# EAGLE design pcb_telemetria (EAGLE 9.4.2)

## Sheet 1 of 5
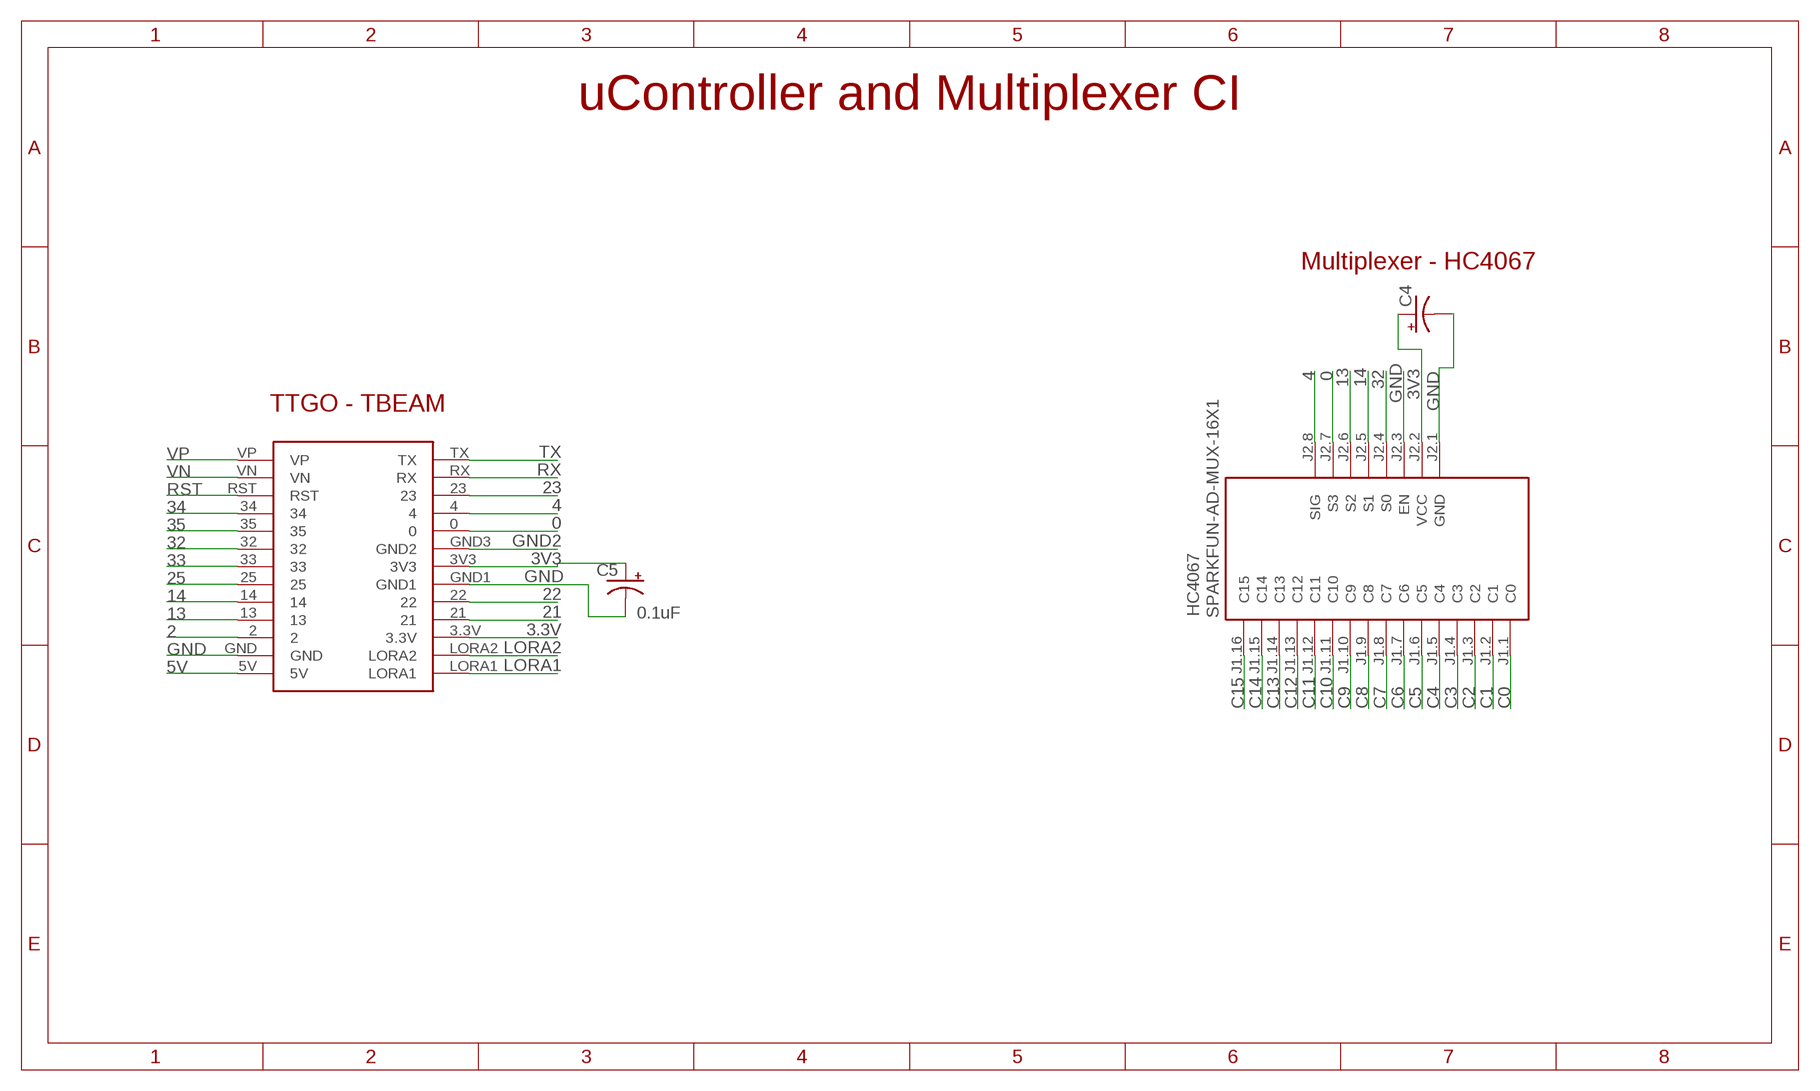
[diagram p0: schematic, sheet 1]

### Parts
C4  CPOL-USE5-5  [E5-5]
C5  0.1uF  CPOL-USE5-5  [E5-5]
HC4067  SPARKFUN-AD-MUX-16X1  [SPARKFUN-AD-MUX-16X1]
U$1  TTGOBEAM  [TTGOBEAM]

### Nets
0: HC4067.J2.7(S3) U$1.0
2: U$1.2 ; also sheet 2
3.3V: U$1.3.3V
3V3: C4.+ C5.+ HC4067.J2.2(VCC) U$1.3V3
4: HC4067.J2.8(SIG) U$1.4
5V: U$1.5V
13: HC4067.J2.6(S2) U$1.13
14: HC4067.J2.5(S1) U$1.14
21: U$1.21 ; also sheet 2
22: U$1.22 ; also sheet 2
23: U$1.23 ; also sheet 2
25: U$1.25 ; also sheet 2
32: HC4067.J2.4(S0) U$1.32
33: U$1.33 ; also sheet 2
34: U$1.34
35: U$1.35
C0: HC4067.J1.1(C0) ; also sheet 4
C1: HC4067.J1.2(C1) ; also sheet 4
C2: HC4067.J1.3(C2) ; also sheet 4
C3: HC4067.J1.4(C3) ; also sheet 4
C4: HC4067.J1.5(C4) ; also sheet 4
C5: HC4067.J1.6(C5) ; also sheet 4
C6: HC4067.J1.7(C6) ; also sheet 3
C7: HC4067.J1.8(C7) ; also sheet 4
C8: HC4067.J1.9(C8) ; also sheet 4
C9: HC4067.J1.10(C9) ; also sheet 4
C10: HC4067.J1.11(C10) ; also sheet 3
C11: HC4067.J1.12(C11) ; also sheet 3
C12: HC4067.J1.13(C12) ; also sheet 3
C13: HC4067.J1.14(C13) ; also sheet 4
C14: HC4067.J1.15(C14) ; also sheet 3
C15: HC4067.J1.16(C15) ; also sheet 3
GND: C4.- C5.- HC4067.J2.1(GND) HC4067.J2.3(EN) U$1.GND U$1.GND1 ; also sheet 2,3,4,5
GND2: U$1.GND3(GND2)
LORA1: U$1.LORA1
LORA2: U$1.LORA2
RST: U$1.RST
RX: U$1.RX ; also sheet 2
TX: U$1.TX ; also sheet 2
VN: U$1.VN
VP: U$1.VP

### Notes on the sheet
- uController and Multiplexer CI
- Multiplexer - HC4067
- TTGO - TBEAM

## Sheet 2 of 5
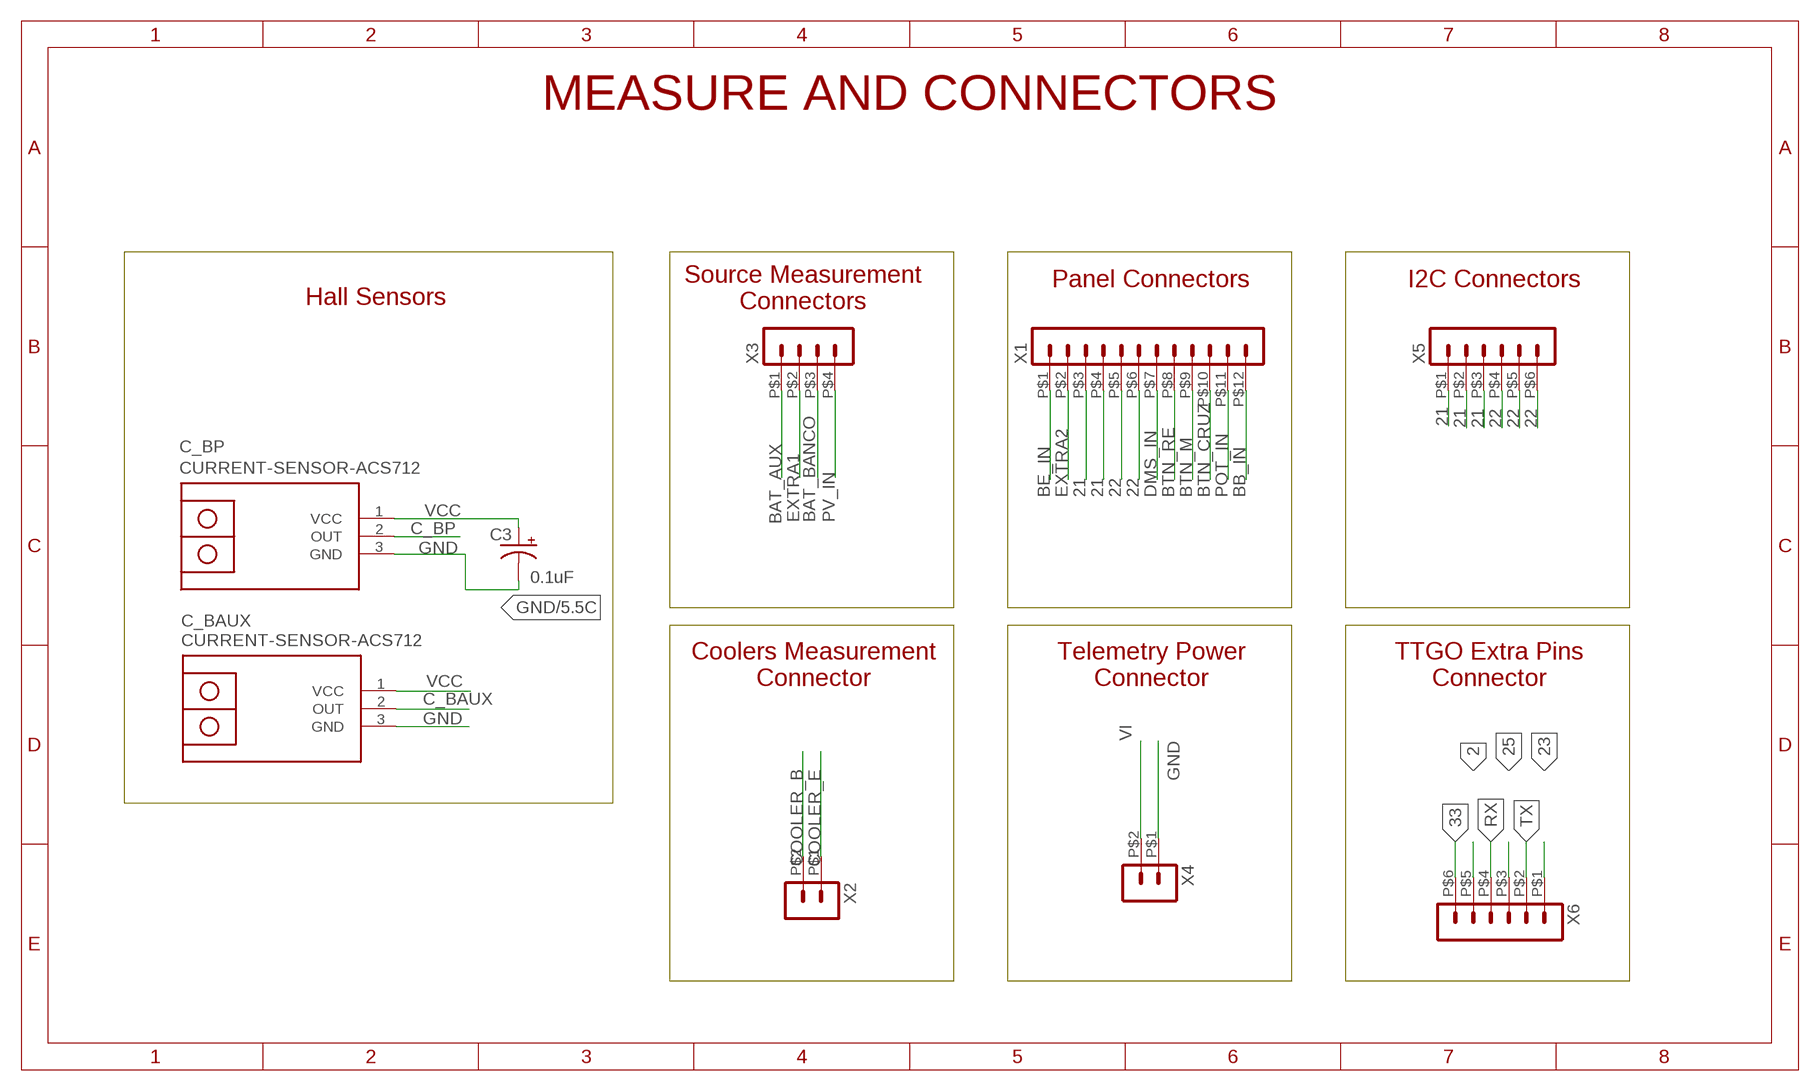
[diagram p1: schematic, sheet 2]

### Parts
C3  0.1uF  CPOL-USE5-5  [E5-5]
C_BAUX  CURRENT-SENSOR-ACS712  [CURRENT-SENSOR-ACS712]
C_BP  CURRENT-SENSOR-ACS712  [CURRENT-SENSOR-ACS712]
X1  HEADER_POS12_43045-1212  [43045-1212]
X2  HEADER_POS2_43045-0212  [43045-0212]
X3  HEADER_POS4_43045-0412  [43045-0412]
X4  HEADER_POS2_43045-0212  [43045-0212]
X5  HEADER_POS6_43045-0612  [43045-0612]
X6  HEADER_POS6_43045-0612  [43045-0612]

### Nets
2: X6.P$5 ; also sheet 1
21: X1.P$3 X1.P$4 X5.P$1 X5.P$2 X5.P$3 ; also sheet 1
22: X1.P$5 X1.P$6 X5.P$4 X5.P$5 X5.P$6 ; also sheet 1
23: X6.P$1 ; also sheet 1
25: X6.P$3 ; also sheet 1
33: X6.P$6 ; also sheet 1
BAT_AUX: X3.P$1 ; also sheet 3
BAT_BANCO: X3.P$3 ; also sheet 3
BB_IN: X1.P$12 ; also sheet 4
BE_IN: X1.P$1 ; also sheet 4
BTN_CRUZ: X1.P$10 ; also sheet 4
BTN_M: X1.P$9 ; also sheet 4
BTN_RE: X1.P$8 ; also sheet 4
C_BAUX: C_BAUX.2(OUT) ; also sheet 3
C_BP: C_BP.2(OUT) ; also sheet 3
COOLER_B: X2.P$2 ; also sheet 4
COOLER_E: X2.P$1 ; also sheet 4
DMS_IN: X1.P$7 ; also sheet 4
EXTRA1: X3.P$2 ; also sheet 4
EXTRA2: X1.P$2 ; also sheet 4
GND: C3.- C_BAUX.3(GND) C_BP.3(GND) X4.P$1 ; also sheet 1,3,4,5
POT_IN: X1.P$11 ; also sheet 3
PV_IN: X3.P$4 ; also sheet 3
RX: X6.P$4 ; also sheet 1
TX: X6.P$2 ; also sheet 1
VCC: C3.+ C_BAUX.1(VCC) C_BP.1(VCC) ; also sheet 5
VI: X4.P$2 ; also sheet 5

### Notes on the sheet
- MEASURE AND CONNECTORS
- Source Measurement
  Connectors
- Panel Connectors | I2C Connectors
- Hall Sensors
- Coolers Measurement
  Connector
- Telemetry Power
  Connector
- TTGO Extra Pins
  Connector

## Sheet 3 of 5
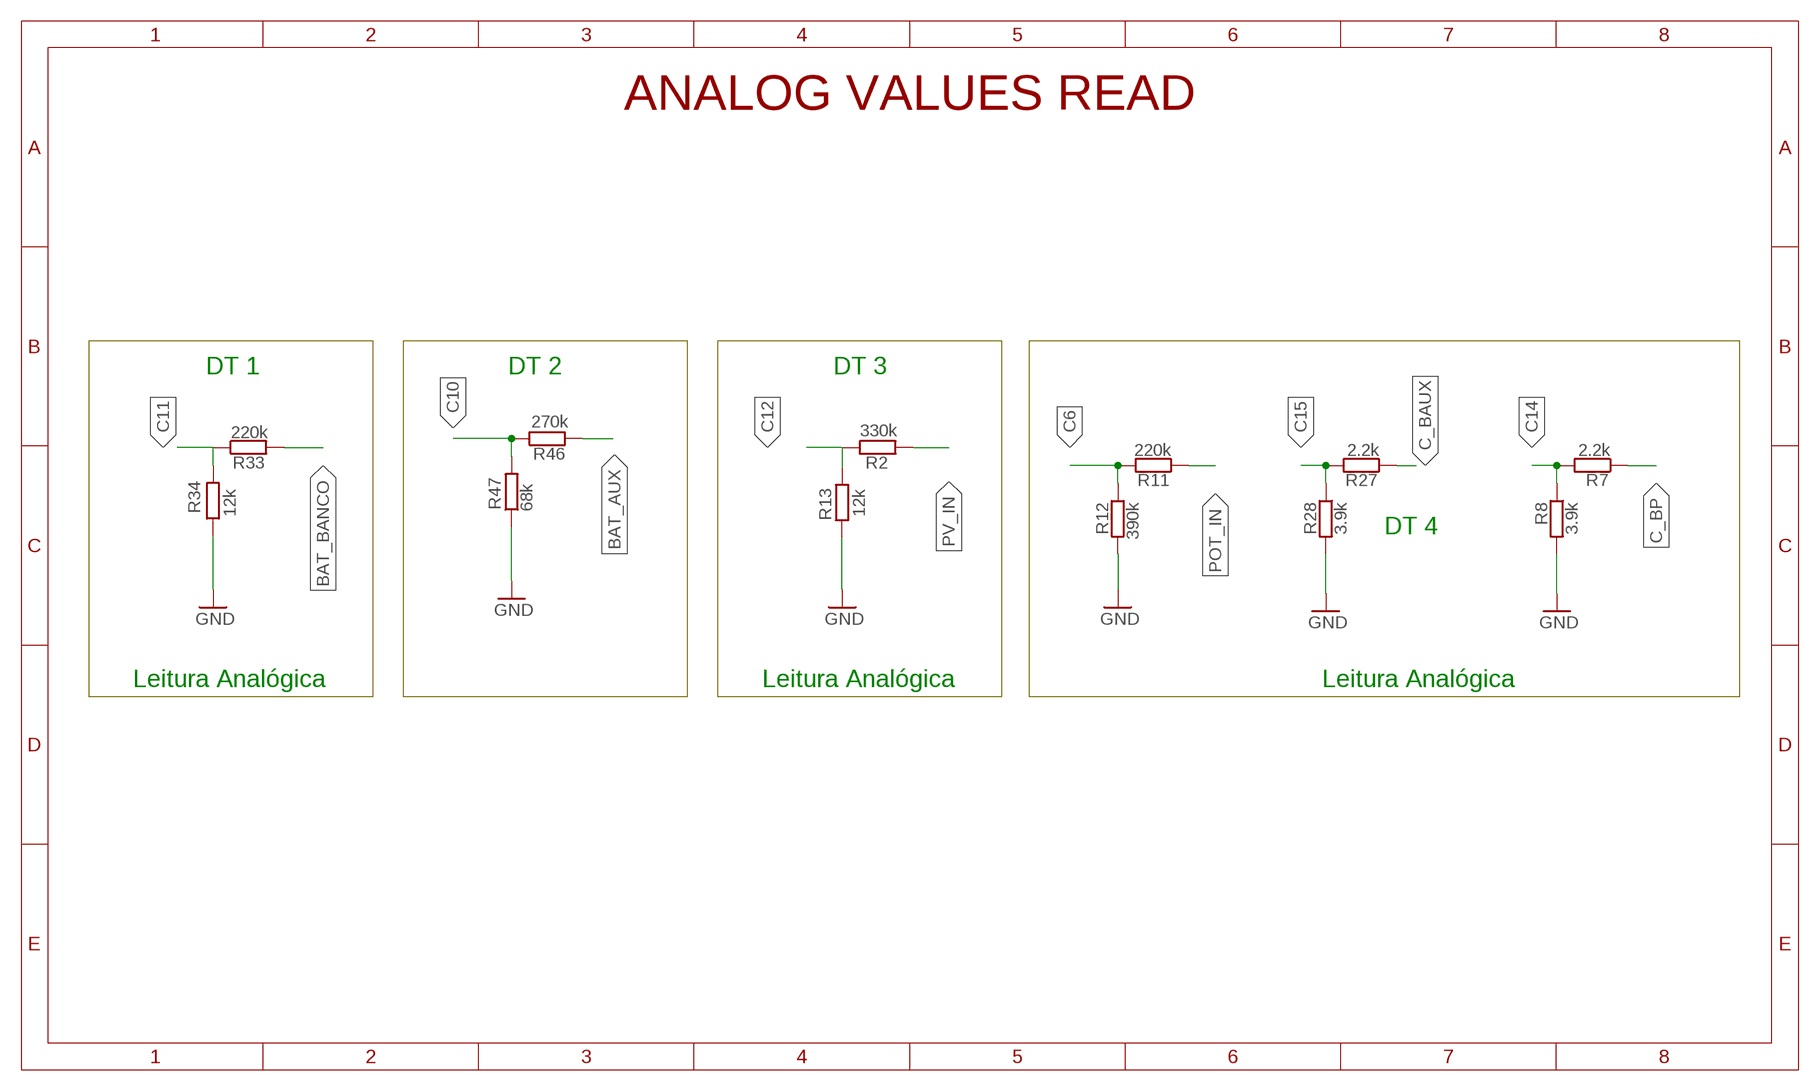
[diagram p2: schematic, sheet 3]

### Parts
R2  330k  R-EU_0204/7  [0204/7]
R7  2.2k  R-EU_0204/7  [0204/7]
R8  3.9k  R-EU_0204/7  [0204/7]
R11  220k  R-EU_0204/7  [0204/7]
R12  390k  R-EU_0204/7  [0204/7]
R13  12k  R-EU_0204/7  [0204/7]
R27  2.2k  R-EU_0204/7  [0204/7]
R28  3.9k  R-EU_0204/7  [0204/7]
R33  220k  R-EU_0204/7  [0204/7]
R34  12k  R-EU_0204/7  [0204/7]
R46  270k  R-EU_0204/7  [0204/7]
R47  68k  R-EU_0204/7  [0204/7]

### Nets
BAT_AUX: R46.2 ; also sheet 2
BAT_BANCO: R33.2 ; also sheet 2
C6: R11.2 R12.1 ; also sheet 1
C10: R46.1 R47.2 ; also sheet 1
C11: R33.1 R34.2 ; also sheet 1
C12: R2.1 R13.2 ; also sheet 1
C14: R7.2 R8.1 ; also sheet 1
C15: R27.2 R28.1 ; also sheet 1
C_BAUX: R27.1 ; also sheet 2
C_BP: R7.1 ; also sheet 2
GND: R8.2 R12.2 R13.1 R28.2 R34.1 R47.1 ; also sheet 1,2,4,5
POT_IN: R11.1 ; also sheet 2
PV_IN: R2.2 ; also sheet 2

### Notes on the sheet
- ANALOG VALUES READ
- DT 1 | DT 2 | DT 3
- DT 4
- Leitura Analógica | Leitura Analógica | Leitura Analógica

## Sheet 4 of 5
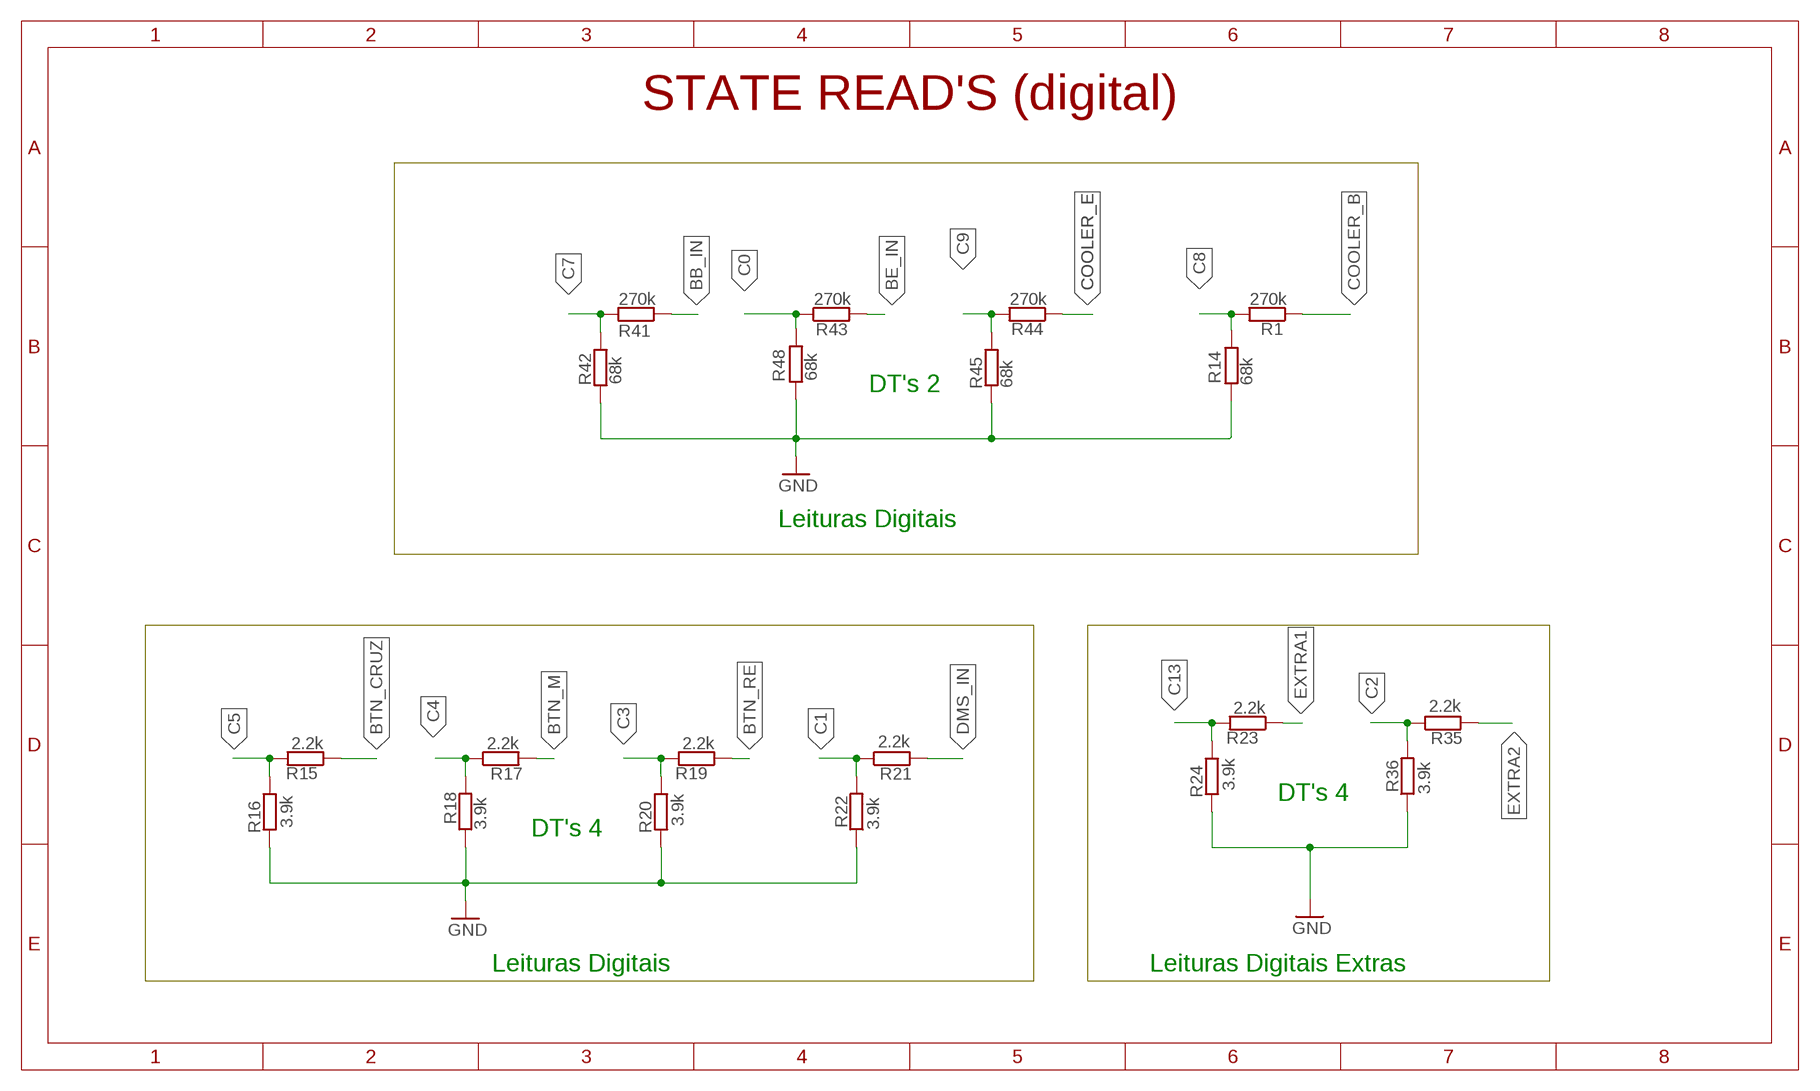
[diagram p3: schematic, sheet 4]

### Parts
R1  270k  R-EU_0204/7  [0204/7]
R14  68k  R-EU_0204/7  [0204/7]
R15  2.2k  R-EU_0204/7  [0204/7]
R16  3.9k  R-EU_0204/7  [0204/7]
R17  2.2k  R-EU_0204/7  [0204/7]
R18  3.9k  R-EU_0204/7  [0204/7]
R19  2.2k  R-EU_0204/7  [0204/7]
R20  3.9k  R-EU_0204/7  [0204/7]
R21  2.2k  R-EU_0204/7  [0204/7]
R22  3.9k  R-EU_0204/7  [0204/7]
R23  2.2k  R-EU_0204/7  [0204/7]
R24  3.9k  R-EU_0204/7  [0204/7]
R35  2.2k  R-EU_0204/7  [0204/7]
R36  3.9k  R-EU_0204/7  [0204/7]
R41  270k  R-EU_0204/7  [0204/7]
R42  68k  R-EU_0204/7  [0204/7]
R43  270k  R-EU_0204/7  [0204/7]
R44  270k  R-EU_0204/7  [0204/7]
R45  68k  R-EU_0204/7  [0204/7]
R48  68k  R-EU_0204/7  [0204/7]

### Nets
BB_IN: R41.1 ; also sheet 2
BE_IN: R43.2 ; also sheet 2
BTN_CRUZ: R15.1 ; also sheet 2
BTN_M: R17.2 ; also sheet 2
BTN_RE: R19.1 ; also sheet 2
C0: R43.1 R48.1 ; also sheet 1
C1: R21.1 R22.2 ; also sheet 1
C2: R35.1 R36.2 ; also sheet 1
C3: R19.2 R20.1 ; also sheet 1
C4: R17.1 R18.2 ; also sheet 1
C5: R15.2 R16.1 ; also sheet 1
C7: R41.2 R42.1 ; also sheet 1
C8: R1.2 R14.2 ; also sheet 1
C9: R44.2 R45.1 ; also sheet 1
C13: R23.2 R24.1 ; also sheet 1
COOLER_B: R1.1 ; also sheet 2
COOLER_E: R44.1 ; also sheet 2
DMS_IN: R21.2 ; also sheet 2
EXTRA1: R23.1 ; also sheet 2
EXTRA2: R35.2 ; also sheet 2
GND: R14.1 R16.2 R18.1 R20.2 R22.1 R24.2 R36.1 R42.2 R45.2 R48.2 ; also sheet 1,2,3,5

### Notes on the sheet
- STATE READ'S (digital)
- DT's 2
- Leituras Digitais
- DT's 4
- DT's 4
- Leituras Digitais | Leituras Digitais Extras

## Sheet 5 of 5
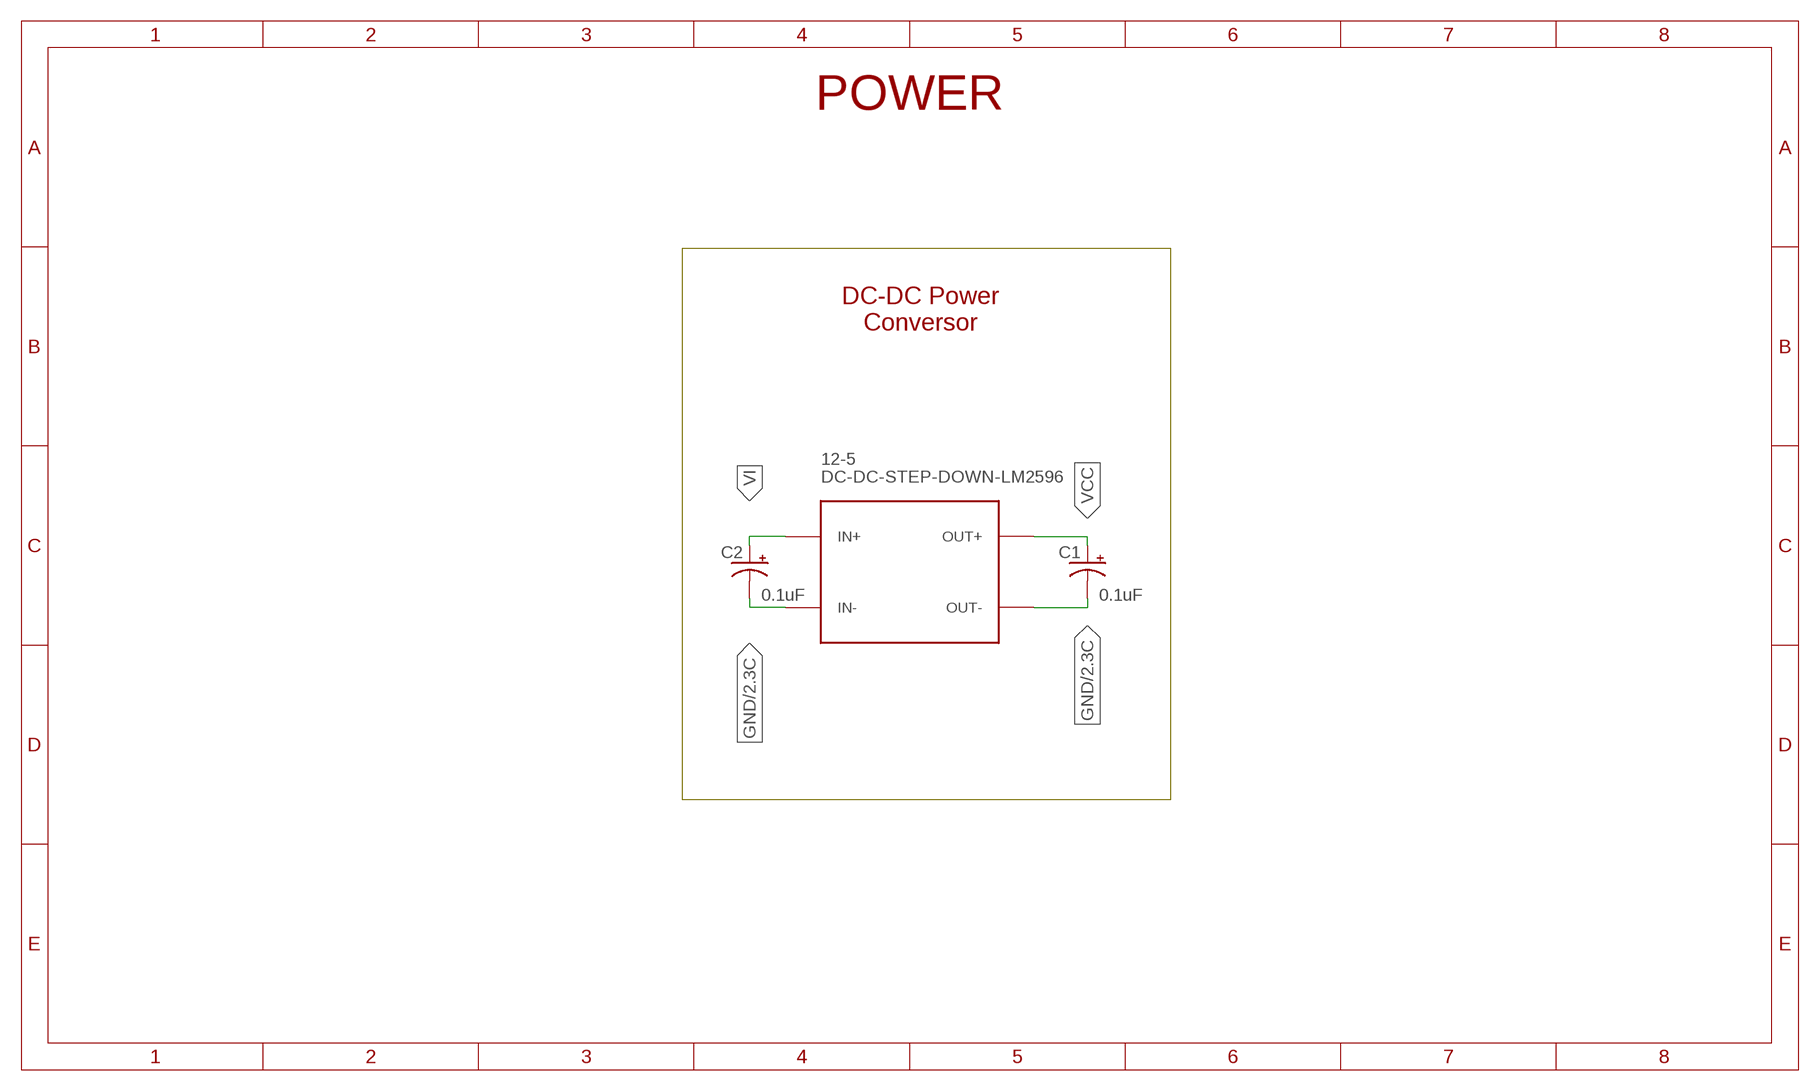
[diagram p4: schematic, sheet 5]

### Parts
12-5  DC-DC-STEP-DOWN-LM2596  [DC-DC-STEP-DOWN-LM2596]
C1  0.1uF  CPOL-USE5-5  [E5-5]
C2  0.1uF  CPOL-USE5-5  [E5-5]

### Nets
GND: 12-5.IN- 12-5.OUT- C1.- C2.- ; also sheet 1,2,3,4
VCC: 12-5.OUT+ C1.+ ; also sheet 2
VI: 12-5.IN+ C2.+ ; also sheet 2

### Notes on the sheet
- POWER
- DC-DC Power
  Conversor

## Library data of the parts
12-5 = diy-modules:DC-DC-STEP-DOWN-LM2596: DC/DC Step-Down Regulator based on LM2596-ADJ chip LM2596 datasheet available here: http://www.ti.com/lit/ds/symlink/lm2596.pdf Click here to find device on ebay.com <http://www.ebay.com/sch/lm2596+power+regulator>
C1-C5 = rcl:CPOL-US: POLARIZED CAPACITOR, American symbol; SPICEPREFIX: C
C_BAUX C_BP = diy-modules:CURRENT-SENSOR-ACS712: Isolated Bipolar Current Sensors based on ACS712 chip More details available here: http://embedded-lab.com/blog/a-brief-overview-of-allegro-acs712-current-sensor-part-1/ Click here to find device on ebay.com <http://www.ebay.com/sch/acs712+module> Note: There are many available versions with different pinout. Please check before use
HC4067 = diy-modules:SPARKFUN-AD-MUX-16X1: SparkFun Analog/Digital MUX Breakout based on CD74HC4067 chip Source: https://www.sparkfun.com/products/9056
R1 R2 R7 R8 R11-R24 R27 R28 R33-R36 R41-R48 = rcl:R-EU_: RESISTOR, European symbol; SPICEPREFIX: R
U$1 = bibliotecattgo:TTGOBEAM
X1 = con-molex-micro-fit-3_0:HEADER_POS12_?: Molex - Micro-Fit 3.0 Series connector, 3.00mm (0.118") pitch header, 12 positions.
X2 X4 = con-molex-micro-fit-3_0:HEADER_POS2_?: Molex - Micro-Fit 3.0 Series connector, 3.00mm (0.118") pitch header, 2 positions.
X3 = con-molex-micro-fit-3_0:HEADER_POS4_?: Molex - Micro-Fit 3.0 Series connector, 3.00mm (0.118") pitch header, 4 positions.
X5 X6 = con-molex-micro-fit-3_0:HEADER_POS6_?: Molex - Micro-Fit 3.0 Series connector, 3.00mm (0.118") pitch header, 6 positions.

## Board
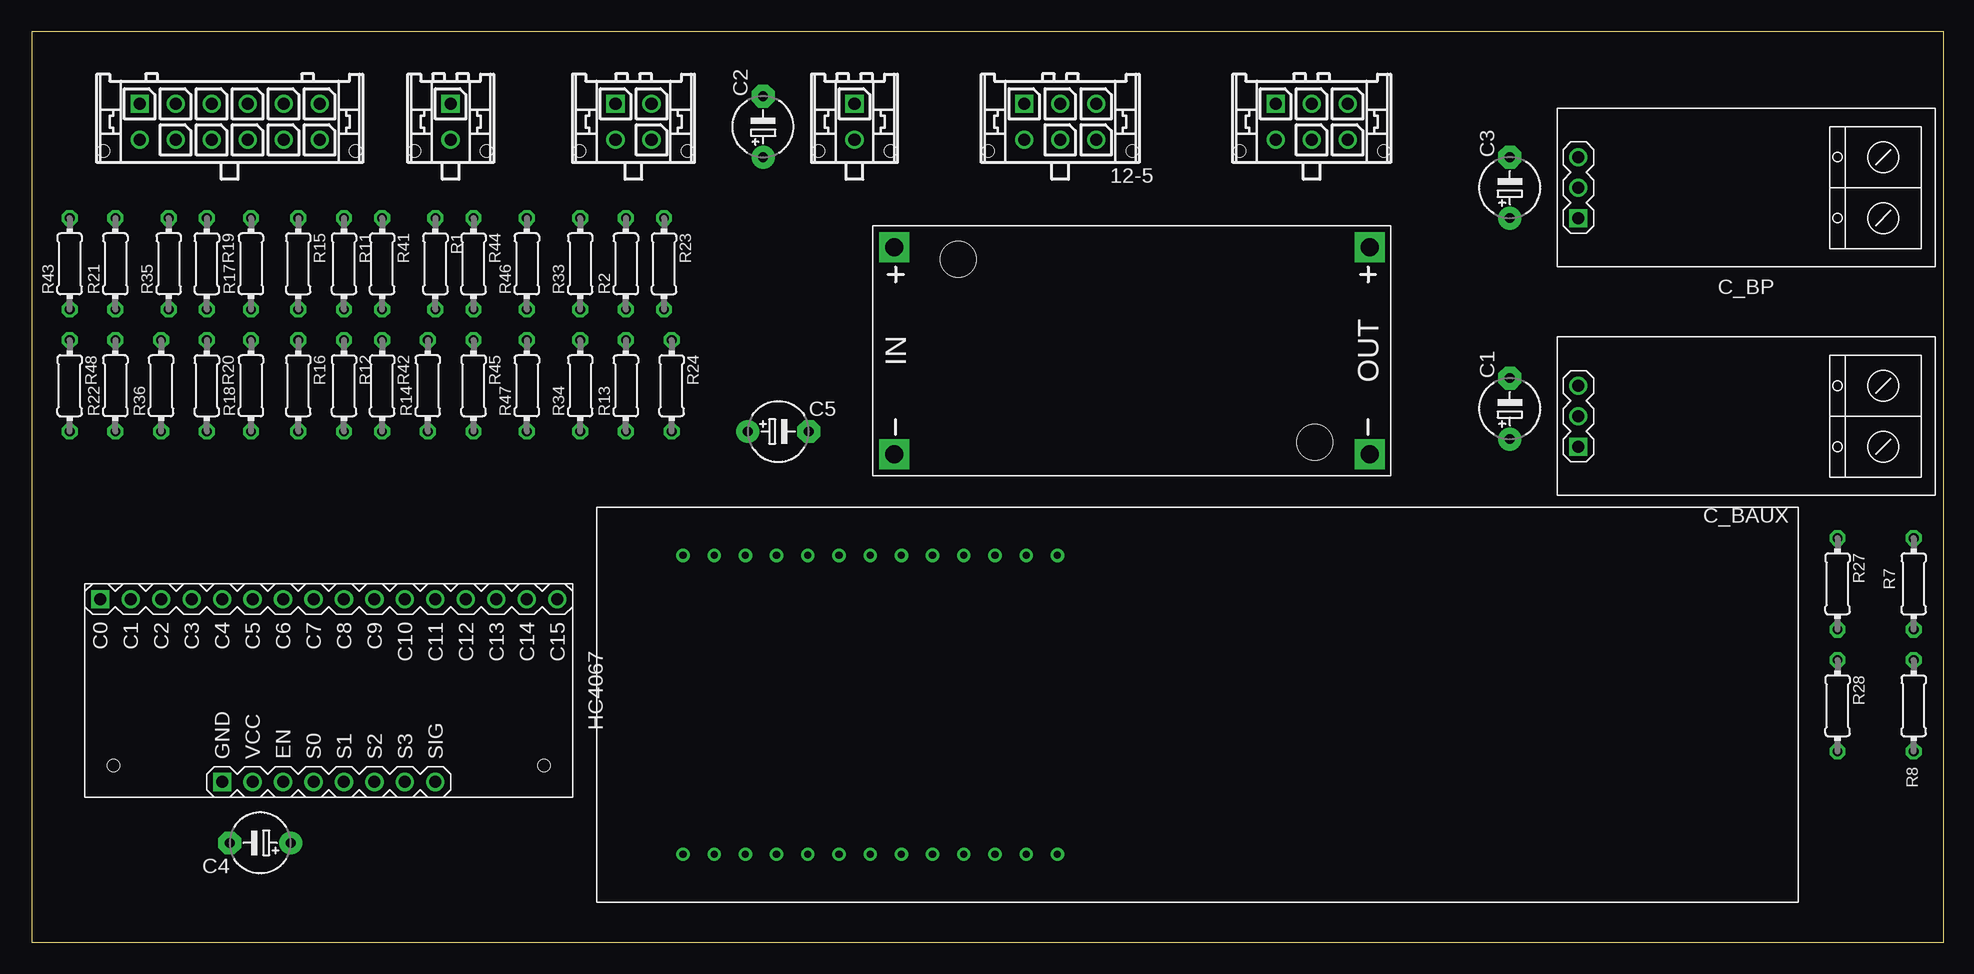
[diagram p5: board, top side]
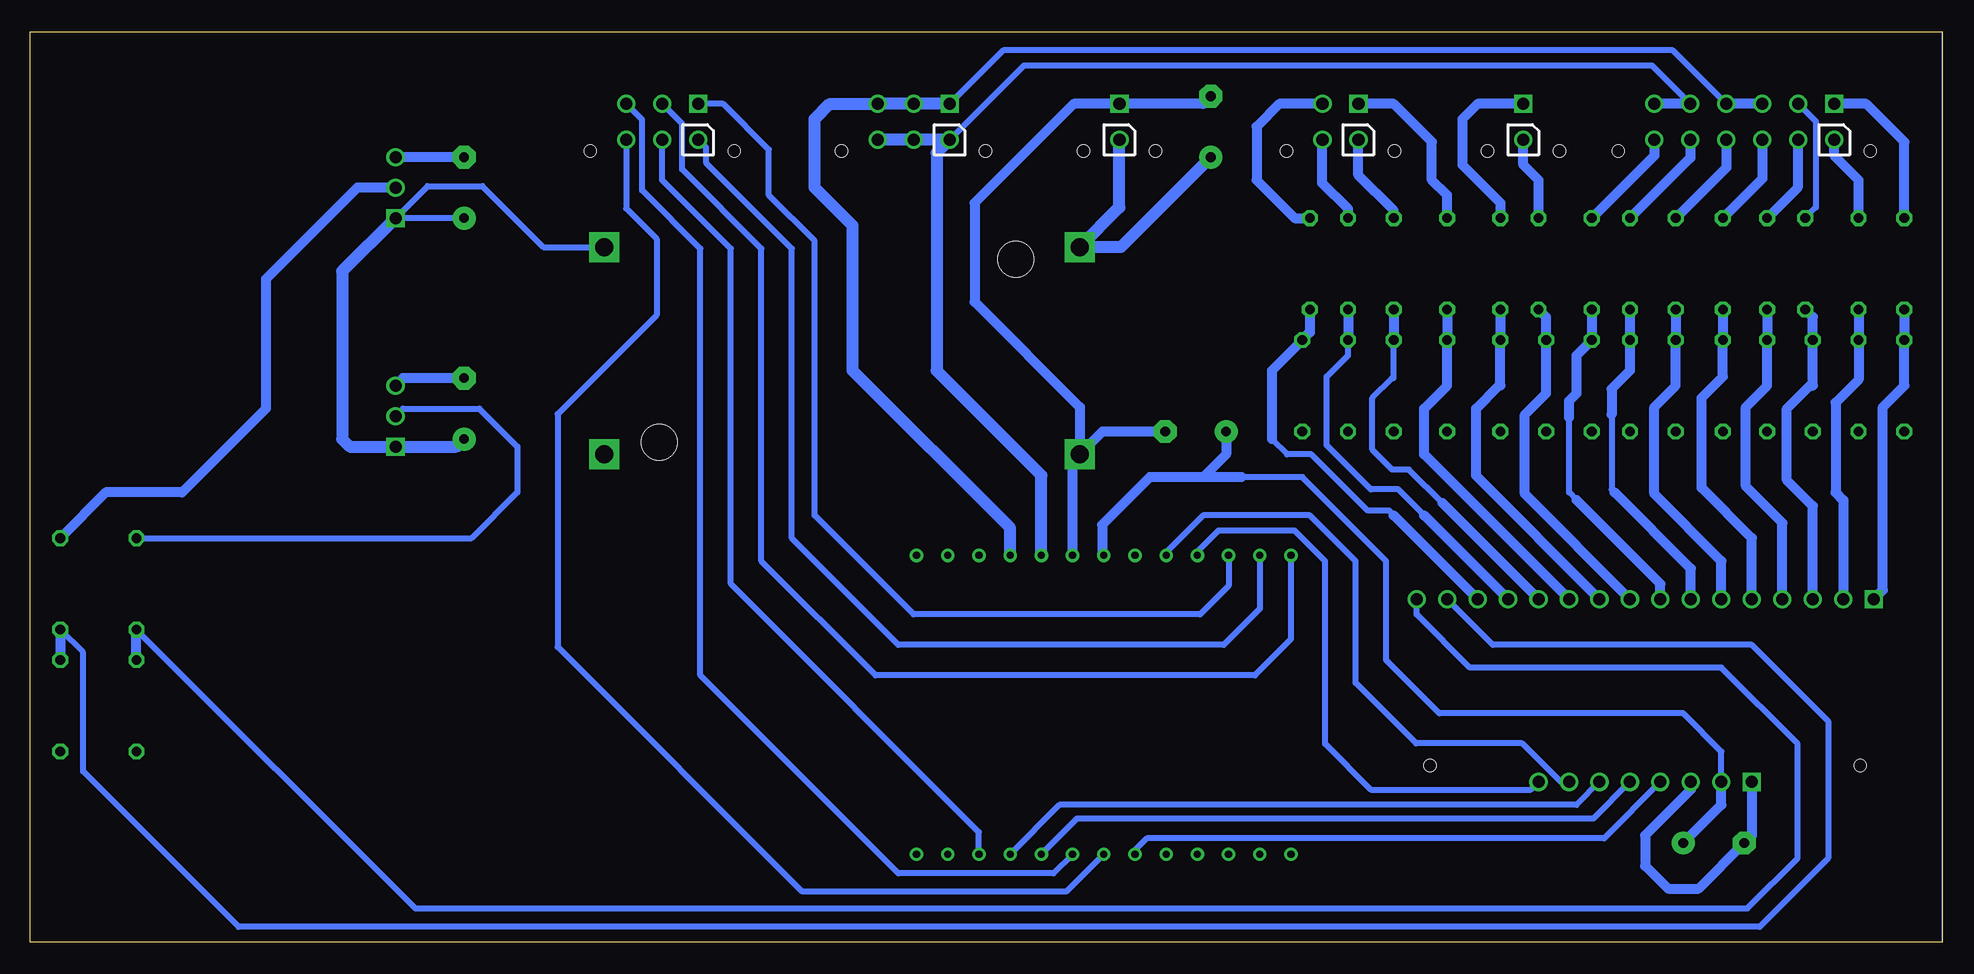
[diagram p6: board, bottom side, seen from below]

Size 159.37 x 75.87 mm. Coordinates in mm from the lower left corner, seen from the top.
Outline: 0,0 159.37,0 159.37,75.87 0,75.87 0,0
Copper layers (1*16): Top 0.035mm / dielectric 1.5mm / Bottom 0.035mm
Design rules "default *": minimum track width 6mil, minimum drill 0.35mm, track to track 10mil, track to pad 12mil, pad to pad 12mil, via to via 12mil, smd to smd 6mil, copper to edge 40mil, drill to drill 6mil, minimum pad ring 10mil, minimum via ring 8mil, stop-mask expansion 4mil, vias tented up to drill 0mil, thermal gap 10mil

### Footprints (pad centres in the part's own frame; a part is rotated, then mirrored left to right if it is on the bottom)
DC-DC-STEP-DOWN-LM2596 = drill 1.5 pad 2.5 square: IN+ -19.812,8.636; IN- -19.812,-8.636; OUT+ 19.812,8.636; OUT- 19.812,-8.636 | hole 3: -14.478,7.62; 15.24,-7.62
E5-5 = drill 0.813 pad 1.905: + -2.54,0 | drill 0.813 pad 1.905 octagon: - 2.54,0
CURRENT-SENSOR-ACS712 = drill 1 square: 1 13.97,2.54 | drill 1: 2 13.97,0; 3 13.97,-2.54
SPARKFUN-AD-MUX-16X1 = drill 1 square: J1.1 -7.62,-19.05; J2.1 7.62,-8.89 | drill 1: J1.2 -7.62,-16.51; J1.3 -7.62,-13.97; J1.4 -7.62,-11.43; J1.5 -7.62,-8.89; J1.6 -7.62,-6.35; J1.7 -7.62,-3.81; J1.8 -7.62,-1.27; J1.9 -7.62,1.27; J1.10 -7.62,3.81; J1.11 -7.62,6.35; J1.12 -7.62,8.89; J1.13 -7.62,11.43; J1.14 -7.62,13.97; J1.15 -7.62,16.51; J1.16 -7.62,19.05; J2.2 7.62,-6.35; J2.3 7.62,-3.81; J2.4 7.62,-1.27; J2.5 7.62,1.27; J2.6 7.62,3.81; J2.7 7.62,6.35; J2.8 7.62,8.89 | hole 1: 6.245,-17.93; 6.245,17.93
0204/7 = drill 0.813 octagon: 1 -3.81,0; 2 3.81,0
TTGOBEAM = drill 0.6: 0 11.9,5.8; 2 -13,-9.8; 3.3V 11.9,-9.8; 3V3 11.9,0.6; 4 11.9,8.4; 5V -13,-15; 13 -13,-7.2; 14 -13,-4.6; 21 11.9,-7.2; 22 11.9,-4.6; 23 11.9,11; 25 -13,-2; 32 -13,3.2; 33 -13,0.6; 34 -13,8.4; 35 -13,5.8; GND -13,-12.4; GND1 11.9,-2; GND3 11.9,3.2; LORA1 11.9,-15; LORA2 11.9,-12.4; RST -13,11; RX 11.9,13.6; TX 11.9,16.2; VN -13,13.6; VP -13,16.2
43045-1212 = drill 1.02 square: P$1 7.5,0 | drill 1.02: P$2 4.5,0; P$3 1.5,0; P$4 -1.5,0; P$5 -4.5,0; P$6 -7.5,0; P$7 7.5,3; P$8 4.5,3; P$9 1.5,3; P$10 -1.5,3; P$11 -4.5,3; P$12 -7.5,3 | hole 1.02: 10.5,3.94; -10.5,3.94
43045-0212 = drill 1.02 square: P$1 0,0 | drill 1.02: P$2 0,3 | hole 1.02: 3,3.94; -3,3.94
43045-0412 = drill 1.02 square: P$1 1.5,0 | drill 1.02: P$2 -1.5,0; P$3 1.5,3; P$4 -1.5,3 | hole 1.02: 4.5,3.94; -4.5,3.94
43045-0612 = drill 1.02 square: P$1 3,0 | drill 1.02: P$2 0,0; P$3 -3,0; P$4 3,3; P$5 0,3; P$6 -3,3 | hole 1.02: 6,3.94; -6,3.94

### Placement (x,y rotation side)
12-5  91.69,49.28 0 top
C1  123.19,44.45 90 top
C2  60.96,67.94 90 top
C3  123.19,62.87 90 top
C4  19.05,8.26 180 top
C5  62.23,42.55 0 top
C_BAUX  142.88,43.81 180 top
C_BP  142.88,62.87 180 top
HC4067  24.77,20.95 270 top
R1  33.66,56.52 270 top
R2  49.53,56.52 90 top
R7  156.84,29.84 270 top
R8  156.84,19.68 270 top
R11  26.04,56.52 270 top
R12  26.04,46.35 270 top
R13  49.53,46.35 90 top
R14  33.02,46.35 90 top
R15  22.23,56.52 270 top
R16  22.23,46.35 270 top
R17  18.29,56.52 90 top
R18  18.29,46.35 90 top
R19  14.61,56.52 270 top
R20  14.61,46.35 270 top
R21  6.99,56.52 90 top
R22  6.99,46.35 90 top
R23  52.7,56.52 270 top
R24  53.34,46.35 270 top
R27  150.5,29.84 270 top
R28  150.5,19.68 270 top
R33  45.72,56.52 90 top
R34  45.72,46.35 90 top
R35  11.43,56.52 90 top
R36  10.79,46.35 90 top
R41  29.21,56.52 270 top
R42  29.21,46.35 270 top
R43  3.17,56.52 90 top
R44  36.83,56.52 270 top
R45  36.83,46.35 270 top
R46  41.27,56.52 90 top
R47  41.27,46.35 90 top
R48  3.17,46.35 270 top
U$1  70.48,20.32 90 top
X1  16.51,69.85 180 top
X2  34.92,69.85 180 top
X3  50.16,69.85 180 top
X4  68.58,69.85 180 top
X5  85.72,69.85 180 top
X6  106.68,69.85 180 top

### Tracks (layer width: path | path; a pad name or v marks a point on that pad's centre or on a via)
0
  Bottom 0.508: HC4067.J2.7 31.8,13.34 35.02,16.55 43.86,16.55 48.9,21.59 48.9,31.75 52.7,35.56 61.59,35.56 64.69,32.47 U$1.0
2
  Bottom 0.508: U$1.2 80.28,9.16 100.97,29.84 100.97,57.78 106.68,63.5 X6.P$5
3V3
  Bottom 0.508: HC4067.J2.2 18.41,15.88 21.59,19.05 41.91,19.05 46.35,23.5 46.35,31.75 53.34,38.73 58.42,38.73
  Bottom 0.813: C4.+ 18.41,11.43 HC4067.J2.2 | 61.59,38.73 59.69,40.64 C5.+ | 58.42,38.73 61.59,38.73 | 61.59,38.73 66.04,38.73 70.02,34.76 70.02,32.35 U$1.3V3
4
  Bottom 0.508: HC4067.J2.8 34.29,12.7 47.62,12.7 51.44,16.51 51.44,31.75 53.98,34.29 60.33,34.29 62.09,32.53 U$1.4
13
  Bottom 0.508: HC4067.J2.6 30.48,11.43 73.58,11.43 U$1.13
14
  Bottom 0.508: HC4067.J2.5 29.08,10.29 72.12,10.29 U$1.14
21
  Bottom 0.508: X1.P$4 22.45,74.3 78.28,74.3 X5.P$1 | 88.27,69.85 X5.P$3
  Bottom 0.813: X1.P$3 X1.P$4
  Bottom 1.016: U$1.21 77.69,34.51 90.81,47.62 90.81,59.69 93.98,62.87 93.98,68.58 92.71,69.85 88.27,69.85 X5.P$2 X5.P$1
22
  Bottom 0.508: X1.P$5 24.18,73.03 76.55,73.03 X5.P$4 | U$1.22 75.14,32.27
  Bottom 0.813: X1.P$5 X1.P$6
  Bottom 1.016: U$1.22 75.08,38.89 83.82,47.62 83.82,65.75 X5.P$4 X5.P$5 X5.P$6
23
  Bottom 0.508: U$1.23 59.48,29.68 61.86,27.3 85.72,27.3 93.98,35.56 93.98,58.42 97.79,62.23 97.79,66.04 101.6,69.85 X6.P$1
25
  Bottom 0.508: U$1.25 74.09,5.71 87,5.71 103.5,22.23 103.5,57.78 108.36,62.64 108.36,68.53 X6.P$3
32
  Bottom 0.508: HC4067.J2.4 28.19,8.64 66.29,8.64 67.28,7.64 U$1.32
33
  Bottom 0.508: U$1.33 73.01,4.19 95,4.19 115.39,24.59 115.39,43.99 107.14,52.24 107.14,58.59 109.68,61.13 X6.P$6
BAT_AUX
  Bottom 0.813: R46.2 41.27,62.23 42.55,63.5 42.55,66.67 45.72,69.85 X3.P$1
BAT_BANCO
  Bottom 0.813: R33.2 45.72,60.96 48.66,63.91 X3.P$3
BB_IN
  Bottom 0.813: X1.P$12 24.01,65.53 R41.1
BE_IN
  Bottom 0.813: R43.2 3.17,66.67 6.35,69.85 X1.P$1
BTN_CRUZ
  Bottom 0.813: X1.P$10 18.01,64.54 R15.1
BTN_M
  Bottom 0.813: R17.2 14.99,63.63 15.01,63.65 X1.P$9
BTN_RE
  Bottom 0.813: X1.P$8 12.06,66.8 12.06,62.87 R19.1
C0
  Bottom 0.813: HC4067.J1.1 4.95,29.34 4.95,44.58 3.17,46.35 R48.1 R43.1
C1
  Bottom 0.813: R21.1 R22.2 6.99,46.86 8.89,44.96 8.89,37.47 8.26,36.83 HC4067.J1.2
C2
  Bottom 0.813: HC4067.J1.3 10.79,36.32 12.95,38.48 12.95,44.45 11.05,46.35 10.79,46.35 R36.2 10.79,52.07 R35.1
C3
  Bottom 0.813: HC4067.J1.4 13.34,34.92 16.38,37.97 16.38,44.58 14.61,46.35 R20.1 R19.2
C4
  Bottom 0.813: HC4067.J1.5 15.88,33.66 20.07,37.85 20.07,45.34 18.29,47.12 R18.2 R17.1
C5
  Bottom 0.813: HC4067.J1.6 18.41,31.75 24,37.34 24,44.58 22.23,46.35 R16.1 R15.2
C6
  Bottom 0.508: 27.3,37.47 27.56,37.72 27.56,43.94
  Bottom 0.813: HC4067.J1.7 20.95,31.11 27.3,37.47 | 27.56,43.94 27.56,46.1 26.04,47.62 R12.1 R11.2
C7
  Bottom 0.508: 30.48,36.83 31.11,37.47 31.11,43.69
  Bottom 0.813: HC4067.J1.8 23.5,29.84 30.48,36.83 | 31.11,43.69 31.11,45.09 30.48,45.72 30.48,48.9 R42.1 R41.2
C8
  Bottom 0.813: HC4067.J1.9 34.8,37.34 34.8,43.94 33.02,45.72 R14.2 33.02,52.07 R1.2
C9
  Bottom 0.813: HC4067.J1.10 38.86,38.86 38.86,44.45 36.96,46.35 36.83,46.35 R45.1 R44.2
C10
  Bottom 0.813: HC4067.J1.11 43.18,40.64 43.18,44.45 41.27,46.35 R47.2 R46.1
C11
  Bottom 0.508: 41.66,36.58 44.45,39.37 45.85,39.37 47.5,41.02 47.5,45.34 45.85,46.99 45.72,46.99 R34.2
  Bottom 0.813: HC4067.J1.12 41.66,36.58 | R33.1 R34.2
C12
  Bottom 0.508: 43.18,35.56 45.34,37.72 47.62,37.72 51.31,41.4 51.31,47.12 49.53,48.9 R13.2
  Bottom 0.813: HC4067.J1.13 43.18,35.56 | R2.1 R13.2
C13
  Bottom 0.508: 45.72,35.56 46.1,35.94 47.88,35.94 52.58,40.64 54.61,40.64 55.88,41.91
  Bottom 0.813: HC4067.J1.14 45.72,35.56 | R23.2 52.7,50.8 R24.1 55.88,47.62 55.88,41.91
C14
  Bottom 0.508: HC4067.J1.15 37.47,24.77 15.88,24.77 9.53,18.41 9.53,6.99 15.24,1.27 141.99,1.27 154.94,14.22 154.94,24.13 R7.2
  Bottom 0.813: R7.2 R8.1
C15
  Bottom 0.508: R27.2 127.25,2.79 16.26,2.79 12.06,6.99 12.06,16.51 18.41,22.86 39.37,22.86 43.81,27.3 HC4067.J1.16
  Bottom 0.813: R28.1 R27.2
C_BAUX
  Bottom 0.508: R27.1 122.56,33.66 118.75,37.47 118.75,41.27 121.92,44.45 128.27,44.45 C_BAUX.2
C_BP
  Bottom 0.813: C_BP.2 132.08,62.87 139.7,55.24 139.7,44.45 146.69,37.47 153.03,37.47 R7.1
COOLER_B
  Bottom 0.813: R1.1 33.66,63.5 34.92,64.77 X2.P$2
COOLER_E
  Bottom 0.813: X2.P$1 38.73,69.85 40.01,68.58 40.01,64.77 36.83,61.59 R44.1
DMS_IN
  Bottom 0.813: R21.2 6.99,63.5 9.01,65.53 X1.P$7
EXTRA1
  Bottom 0.813: X3.P$2 55.24,69.85 57.15,67.94 57.15,63.5 53.98,60.33 R23.1
EXTRA2
  Bottom 0.508: X1.P$2 10.54,68.38 10.54,61.21 R35.2
GND
  Bottom 0.813: HC4067.J2.1 15.88,8.89 C4.- 20.32,4.45 22.86,4.45 24.77,6.35 24.77,8.89 20.95,12.7 HC4067.J2.3 | U$1.GND1 72.48,40.04 12-5.IN- | 12-5.IN- 69.98,42.55 C5.- | C2.- 61.59,69.85 X4.P$1 72.39,69.85 80.64,61.59 80.64,53.34 71.88,44.58 12-5.IN- | C1.- 128.27,46.99 C_BAUX.3 | C3.- C_BP.3
POT_IN
  Bottom 0.813: X1.P$11 21.01,65.35 R11.1
PV_IN
  Bottom 0.813: R2.2 49.53,61.09 51.69,63.25 51.69,66.83 X3.P$4
RX
  Bottom 0.508: U$1.RX 56.88,27.77 59.9,24.77 87,24.77 95.89,33.66 95.89,57.78 103.05,64.94 103.05,66.22 X6.P$4
TX
  Bottom 0.508: U$1.TX 54.28,25.23 57.3,22.23 88.9,22.23 98.42,31.75 98.42,57.78 105.03,64.39 105.03,68.2 X6.P$2
VCC
  Bottom 0.508: 12-5.OUT+ 116.59,57.91 121.67,62.99 126.24,62.99 C_BP.1 C3.+
  Bottom 1.016: C_BP.1 133.35,55.88 133.35,41.91 132.72,41.27 C_BAUX.1 123.83,41.27 C1.+
VI
  Bottom 1.016: C2.+ 68.45,57.91 12-5.IN+ 68.58,61.21 X4.P$2
(copper drawn outside any net)
  shapes: Bottom area x1